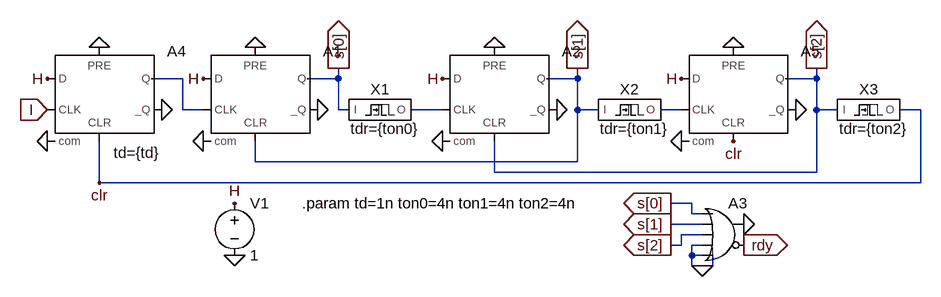
[diagram p0: schematic sm_seq_timer_3state.asc]
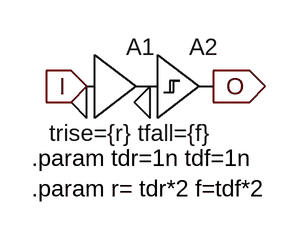
[diagram p1: sub-circuit delay.asc]
sm_seq_timer_3state.asc, the LTspice schematic file:
Version 4
SHEET 1 880 712
WIRE -1152 112 -1200 112
WIRE -912 112 -912 96
WIRE -912 112 -960 112
WIRE -544 112 -544 96
WIRE -544 112 -592 112
WIRE -176 112 -176 96
WIRE -176 112 -224 112
WIRE -1152 160 -1152 112
WIRE -1120 160 -1152 160
WIRE -912 160 -912 112
WIRE -896 160 -912 160
WIRE -752 160 -800 160
WIRE -544 160 -544 112
WIRE -512 160 -544 160
WIRE -384 160 -416 160
WIRE -176 160 -176 112
WIRE -144 160 -176 160
WIRE -16 160 -48 160
WIRE -1040 240 -1040 208
WIRE -544 240 -544 160
WIRE -544 240 -1040 240
WIRE -672 256 -672 208
WIRE -176 256 -176 160
WIRE -176 256 -672 256
WIRE -1280 272 -1280 208
WIRE -16 272 -16 160
WIRE -16 272 -1280 272
WIRE -368 304 -400 304
WIRE -368 320 -368 304
WIRE -352 320 -368 320
WIRE -352 336 -400 336
WIRE -352 352 -384 352
WIRE -384 368 -384 352
WIRE -384 368 -400 368
WIRE -352 368 -368 368
WIRE -368 384 -368 368
WIRE -352 384 -368 384
WIRE -368 400 -368 384
WIRE -352 400 -368 400
WIRE -336 400 -336 384
WIRE -336 400 -352 400
FLAG -1120 208 0
FLAG -752 208 0
FLAG -1040 64 0
FLAG -1360 160 I
IOPIN -1360 160 In
FLAG -672 64 0
FLAG -544 96 s[1]
IOPIN -544 96 Out
FLAG -944 160 0
FLAG -576 160 0
FLAG -1072 384 0
FLAG -1072 304 H
FLAG -1120 112 H
FLAG -752 112 H
FLAG -912 96 s[0]
IOPIN -912 96 Out
FLAG -352 400 0
FLAG -288 336 0
FLAG -400 304 s[0]
IOPIN -400 304 Out
FLAG -400 336 s[1]
IOPIN -400 336 Out
FLAG -288 368 rdy
IOPIN -288 368 Out
FLAG -1360 208 0
FLAG -1280 64 0
FLAG -1184 160 0
FLAG -1360 112 H
FLAG -1280 272 clr
FLAG -384 208 0
FLAG -304 64 0
FLAG -176 96 s[2]
IOPIN -176 96 Out
FLAG -208 160 0
FLAG -384 112 H
FLAG -304 208 clr
FLAG -400 368 s[2]
IOPIN -400 368 Out
SYMBOL voltage -1072 288 R0
SYMATTR InstName V1
SYMATTR Value 1
SYMBOL Digital\\dflop -1040 64 R0
WINDOW 3 0 0 Invisible 0
SYMATTR Value td=0.5n
SYMATTR InstName A1
SYMBOL Digital\\dflop -672 64 R0
WINDOW 3 0 0 Invisible 0
SYMATTR Value td=0.5n
SYMATTR InstName A2
SYMBOL Digital\\or -320 288 R0
SYMATTR InstName A3
SYMBOL Digital\\dflop -1280 64 R0
WINDOW 3 22 162 Left 2
SYMATTR Value td={td}
SYMATTR InstName A4
SYMBOL delay -848 160 R0
WINDOW 39 8 45 Bottom 2
SYMATTR SpiceLine tdr={ton0}
SYMATTR InstName X1
SYMBOL delay -464 160 R0
WINDOW 39 8 45 Bottom 2
SYMATTR SpiceLine tdr={ton1}
SYMATTR InstName X2
SYMBOL Digital\\dflop -304 64 R0
WINDOW 3 0 0 Invisible 0
SYMATTR Value td=0.5n
SYMATTR InstName A5
SYMBOL delay -96 160 R0
WINDOW 39 8 45 Bottom 2
SYMATTR SpiceLine tdr={ton2}
SYMATTR InstName X3
TEXT -968 304 Left 2 !.param td=1n ton0=4n ton1=4n ton2=4n

delay.asc, the sub-circuit schematic file:
Version 4
SHEET 1 880 680
FLAG 144 176 0
FLAG 208 176 0
FLAG 272 160 O
IOPIN 272 160 Out
FLAG 144 160 I
IOPIN 144 160 In
SYMBOL Digital\\buf1 144 96 R0
WINDOW 3 -38 111 Left 2
SYMATTR Value trise={r} tfall={f}
SYMATTR InstName A1
SYMBOL Digital\\schmtbuf 208 96 R0
SYMATTR InstName A2
TEXT 88 232 Left 2 !.param tdr=1n tdf=1n\n.param r= tdr*2 f=tdf*2

The netlist it stands for:
* sm_seq_timer_3state.asc
V1 H 0 1
A1 H 0 N001 0 s[1] 0 s[0] 0 DFLOP td=0.5n
A2 H 0 N002 0 s[2] 0 s[1] 0 DFLOP td=0.5n
A3 s[0] s[1] s[2] 0 0 rdy 0 0 OR
A4 H 0 I 0 clr 0 N001 0 DFLOP td={td}
XX1 s[0] N002 delay params: tdr={ton0}
XX2 s[1] N003 delay params: tdr={ton1}
A5 H 0 N003 0 clr 0 s[2] 0 DFLOP td=0.5n
XX3 s[2] clr delay params: tdr={ton2}

* block symbol definitions
.subckt delay I O
A1 I 0 0 0 0 0 P001 0 BUF trise={r} tfall={f}
A2 P001 0 0 0 0 0 O 0 SCHMITT
.param tdr=1n tdf=1n
.param r= tdr*2 f=tdf*2
.ends delay

.param td=1n ton0=4n ton1=4n ton2=4n
.backanno
.end